# EAGLE schematic VehicleDAQ (EAGLE 9.6.2)
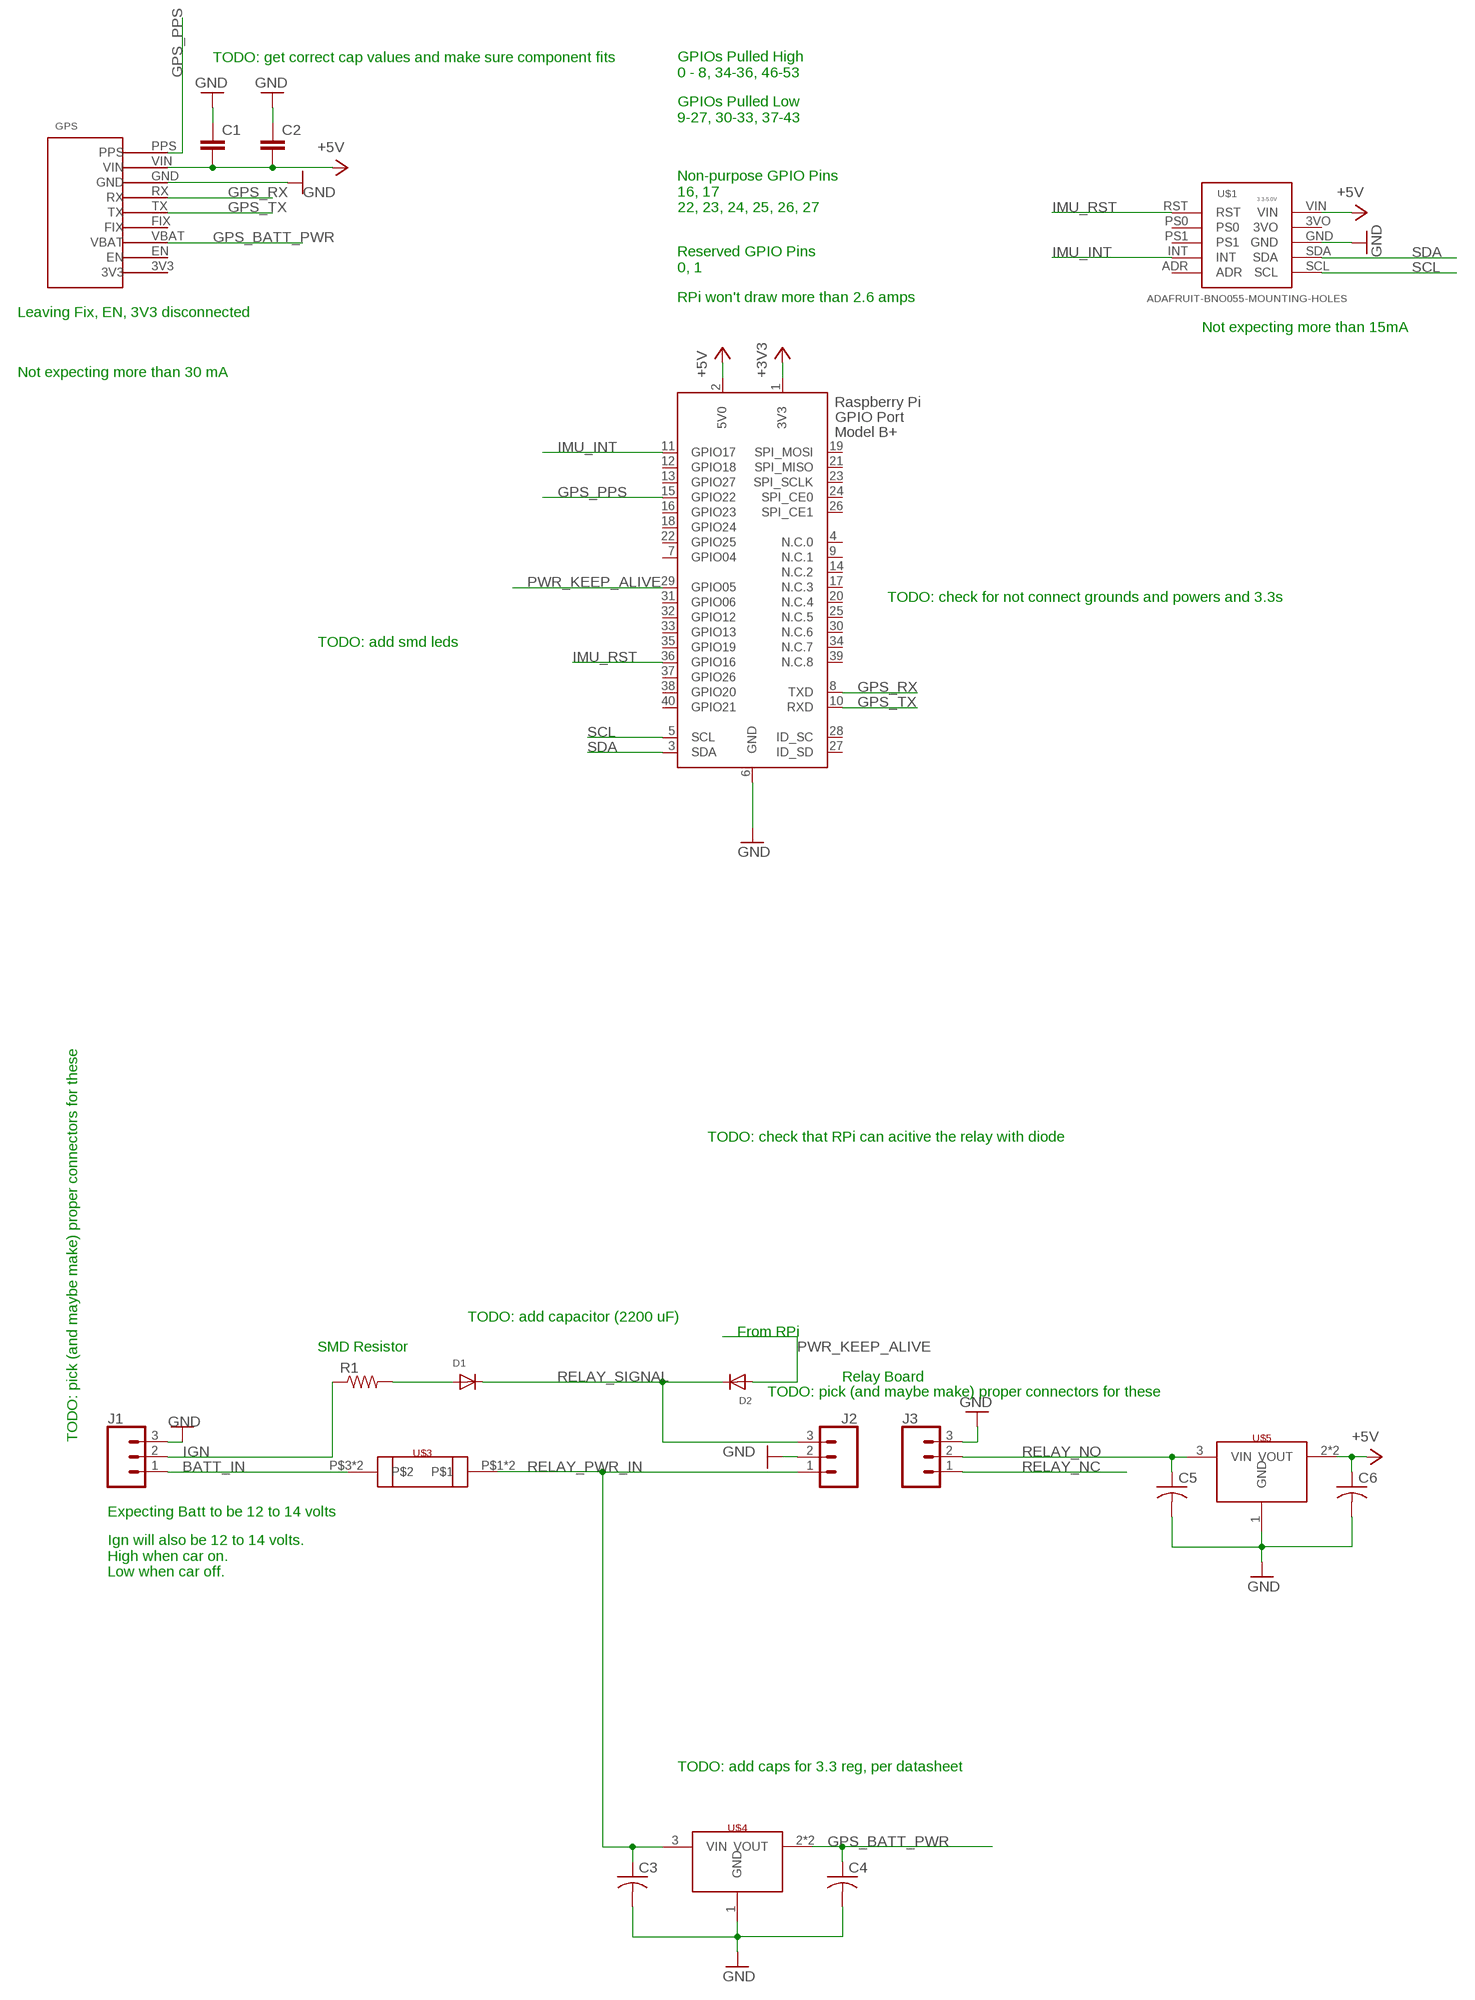
[diagram p0: schematic, sheet 1]

## Parts
C1  C-EU025-030X050  [C025-030X050]
C2  C-EU025-030X050  [C025-030X050]
C3  C-USC1206K  [C1206K]
C4  C-USC1206K  [C1206K]
C5  C-USC1206K  [C1206K]
C6  C-USC1206K  [C1206K]
D1  DIODEDO-1N4148  [DO-1N4148]
D2  DIODEDO-1N4148  [DO-1N4148]
J1  CONN_03SCREW_LOCK  [SCREWTERMINAL-3.5MM-3_LOCK.007S]
J2  CONN_03  [1X03]
J3  CONN_03  [1X03]
R1  R-US_R1206W  [R1206W]
U$1  ADAFRUIT-BNO055-MOUNTING-HOLES  [ADAFRUIT-BNO055-MOUNTING-HOLES]
U$2  ADAFRUIT-ULTIMATE-GPS-MOUNTING-HOLES  [GPS-WITH-MOUNTING-HOLES]
U$3  BLADE_FUSE_BLOCK  [FUSE_HOLDER]
U$4  LD1085D2M33R_REGULATOR  [TO263-3]
U$5  LD1085D2M33R_REGULATOR  [TO263-3]
X1  RASPI_BOARD_B+_FP  [RASPI_BOARD_B+_FULL_PAD]

## Nets
+3V3: X1.1(3V3)
+5V: C1.2 C2.2 C6.1 U$1.VIN U$2.VIN U$5.2(VOUT) U$5.TAB(VOUT) X1.2(5V0)
BATT_IN: J1.1 U$3.P$3 U$3.P$4
GND: C1.1 C2.1 C3.2 C4.2 C5.2 C6.2 J1.3 J2.2 J3.3 U$1.GND U$2.GND U$4.1(GND) U$5.1(GND) X1.6(GND)
GPS_BATT_PWR: C4.1 U$2.VBAT U$4.2(VOUT) U$4.TAB(VOUT)
GPS_PPS: U$2.PPS X1.15(GPIO22)
GPS_RX: U$2.RX X1.8(TXD)
GPS_TX: U$2.TX X1.10(RXD)
IGN: J1.2 R1.1
IMU_INT: U$1.INT X1.11(GPIO17)
IMU_RST: U$1.RST X1.36(GPIO16)
N$1: D1.A R1.2
PWR_KEEP_ALIVE: D2.A X1.29(GPIO05)
RELAY_NC: J3.1
RELAY_NO: C5.1 J3.2 U$5.3(VIN)
RELAY_PWR_IN: C3.1 J2.1 U$3.P$1 U$3.P$2 U$4.3(VIN)
RELAY_SIGNAL: D1.C D2.C J2.3
SCL: U$1.SCL X1.5(SCL)
SDA: U$1.SDA X1.3(SDA)
Unconnected: U$1.3VO U$1.ADR U$1.PS0 U$1.PS1 U$2.3V3 U$2.EN U$2.FIX X1.4(N.C.0) X1.7(GPIO04) X1.9(N.C.1) X1.12(GPIO18) X1.13(GPIO27) X1.14(N.C.2) X1.16(GPIO23) X1.17(N.C.3) X1.18(GPIO24) X1.19(SPI_MOSI) X1.20(N.C.4) X1.21(SPI_MISO) X1.22(GPIO25) X1.23(SPI_SCLK) X1.24(SPI_CE0) X1.25(N.C.5) X1.26(SPI_CE1) X1.27(ID_SD) X1.28(ID_SC) X1.30(N.C.6) X1.31(GPIO06) X1.32(GPIO12) X1.33(GPIO13) X1.34(N.C.7) X1.35(GPIO19) X1.37(GPIO26) X1.38(GPIO20) X1.39(N.C.8) X1.40(GPIO21)

## Notes on the sheet
- TODO: get correct cap values and make sure component fits
- GPIOs Pulled High
  0 - 8, 34-36, 46-53
- GPIOs Pulled Low
  9-27, 30-33, 37-43
- Non-purpose GPIO Pins
  16, 17
  22, 23, 24, 25, 26, 27
- Reserved GPIO Pins
  0, 1
- RPi won't draw more than 2.6 amps
- Leaving Fix, EN, 3V3 disconnected
- Not expecting more than 15mA
- Not expecting more than 30 mA
- TODO: check for not connect grounds and powers and 3.3s
- TODO: add smd leds
- TODO: check that RPi can acitive the relay with diode
- TODO: add capacitor (2200 uF)
- From RPi
- SMD Resistor
- Relay Board
- TODO: pick (and maybe make) proper connectors for these
- TODO: pick (and maybe make) proper connectors for these
- Expecting Batt to be 12 to 14 volts
- Ign will also be 12 to 14 volts.
  High when car on.
  Low when car off.
- TODO: add caps for 3.3 reg, per datasheet

## Library data of the parts
C1 C2 = rcl:C-EU: CAPACITOR, European symbol; SPICEPREFIX: C
C3-C6 = adafruit:C-US: CAPACITOR, American symbol
D1 D2 = adafruit:DIODE: Diode SMADIODE - SMA Surface Mount Package 20V 1A Schottky Diode Digikey: 641-1014-6-ND DO-1N4148 - Through Hole Small Current Diode SOD-123 20V 1 A (.5mV Vf) Schottky Diode - Digikey: MBRX120TPMSCT-ND SOD-323 10V 570mA (.38mV Vf, 3ns) Schottky Diode - Digikey: ZLLS410CT-ND SOD-523 30V 30mA Schottky Diode (RB751S-40TE61) - Digikey: RB751S-40TE61CT-ND SOT23-R/W - SOT23 Package (R = Solder Paste/Reflow Ovens, W = Hand-Soldering) BAT54Film 40V 300mA - Digikey: 497-7162-1-ND
J1 = SparkFun-Connectors:CONN_03: Multi connection point. Often used as Generic Header-pin footprint for 0.1 inch spaced/style header connections On any of the 0.1 inch spaced packages, you can populate with these: Break Away Headers - Straight <https://www.sparkfun.com/products/116> (PRT-00116) Break Away Male Headers - Right Angle <https://www.sparkfun.com/products/553> (PRT-00553) Female Headers <https://www.sparkfun.com/products/115> (PRT-00115) Break Away Headers - Machine Pin <https://www.sparkfun.com/products/117> (PRT-00117) Break Away Female Headers - Swiss Machine Pin <https://www.sparkfun.com/products/743> (PRT-00743) Stackable Header - 3 Pin (Female, 0.1") <https://www.sparkfun.com/products/13875> (PRT-13875) For SCREWTERMINALS and SPRING TERMINALS visit here: Screw Terimnals on SparkFun.com <https://www.sparkfun.com/search/results?term=Screw+Terminals> (5mm/3.5mm/2.54mm spacing) This device is also useful as a general connection point to wire up your design to another part of your project. Our various solder wires solder well into these plated through hole pads. Hook-Up Wire - Assortment (Stranded, 22 AWG) <https://www.sparkfun.com/products/11375> (PRT-11375) Hook-Up Wire - Assortment (Solid Core, 22 AWG) <https://www.sparkfun.com/products/11367> (PRT-11367) View the entire wire category on our website here <https://www.sparkfun.com/categories/141> Special notes: Molex polarized connector foot print use with SKU : PRT-08232 with associated crimp pins and housings.; PROD_ID: CONN-08288; SF_ID: PRT-08235
J2 J3 = SparkFun-Connectors:CONN_03: Multi connection point. Often used as Generic Header-pin footprint for 0.1 inch spaced/style header connections On any of the 0.1 inch spaced packages, you can populate with these: Break Away Headers - Straight <https://www.sparkfun.com/products/116> (PRT-00116) Break Away Male Headers - Right Angle <https://www.sparkfun.com/products/553> (PRT-00553) Female Headers <https://www.sparkfun.com/products/115> (PRT-00115) Break Away Headers - Machine Pin <https://www.sparkfun.com/products/117> (PRT-00117) Break Away Female Headers - Swiss Machine Pin <https://www.sparkfun.com/products/743> (PRT-00743) Stackable Header - 3 Pin (Female, 0.1") <https://www.sparkfun.com/products/13875> (PRT-13875) For SCREWTERMINALS and SPRING TERMINALS visit here: Screw Terimnals on SparkFun.com <https://www.sparkfun.com/search/results?term=Screw+Terminals> (5mm/3.5mm/2.54mm spacing) This device is also useful as a general connection point to wire up your design to another part of your project. Our various solder wires solder well into these plated through hole pads. Hook-Up Wire - Assortment (Stranded, 22 AWG) <https://www.sparkfun.com/products/11375> (PRT-11375) Hook-Up Wire - Assortment (Solid Core, 22 AWG) <https://www.sparkfun.com/products/11367> (PRT-11367) View the entire wire category on our website here <https://www.sparkfun.com/categories/141> Special notes: Molex polarized connector foot print use with SKU : PRT-08232 with associated crimp pins and housings.
R1 = rcl:R-US_: RESISTOR, American symbol; SPICEPREFIX: R
U$1 = Adafruit BNO055:ADAFRUIT-BNO055-MOUNTING-HOLES
U$2 = Adafruit Ultimate GPS Breakout:ADAFRUIT-ULTIMATE-GPS-MOUNTING-HOLES
U$3 = keverly:BLADE_FUSE_BLOCK
U$4 U$5 = keverly:LD1085D2M33R_REGULATOR
X1 = raspberrypi_bastelstube_v13:RASPI_BOARD_B+: Raspberry Pi GPIO connector with markings for the outer dimensions of the Raspberry Pi board model B+ with different sets of drill holes or mounting pads